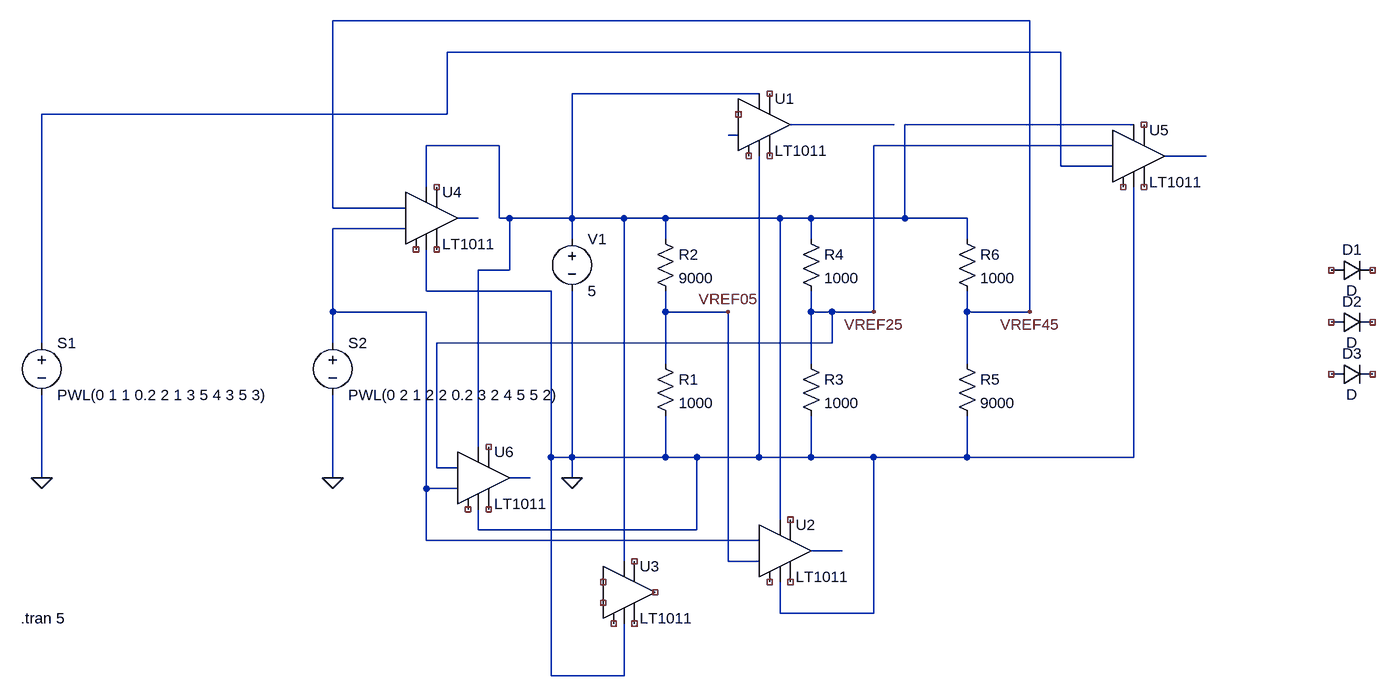
[diagram p0: schematic f1flop.asc]
f1flop.asc, the LTspice schematic file:
Version 4.1
SHEET 1 1592 680
WIRE 1056 -736 -16 -736
WIRE 1104 -688 160 -688
WIRE 640 -624 352 -624
WIRE 160 -592 160 -688
WIRE 160 -592 -464 -592
WIRE 848 -576 688 -576
WIRE 1216 -576 864 -576
WIRE 608 -560 592 -560
WIRE 240 -544 128 -544
WIRE 1184 -544 816 -544
WIRE 1328 -528 1264 -528
WIRE 1104 -512 1104 -688
WIRE 1184 -512 1104 -512
WIRE 128 -480 128 -544
WIRE -16 -448 -16 -736
WIRE 96 -448 -16 -448
WIRE 208 -432 176 -432
WIRE 240 -432 240 -544
WIRE 256 -432 240 -432
WIRE 352 -432 352 -624
WIRE 352 -432 256 -432
WIRE 432 -432 352 -432
WIRE 496 -432 432 -432
WIRE 672 -432 496 -432
WIRE 720 -432 672 -432
WIRE 864 -432 864 -576
WIRE 864 -432 720 -432
WIRE 960 -432 864 -432
WIRE 96 -416 -16 -416
WIRE 352 -400 352 -432
WIRE 496 -400 496 -432
WIRE 720 -400 720 -432
WIRE 960 -400 960 -432
WIRE 256 -352 256 -432
WIRE 256 -352 208 -352
WIRE 128 -320 128 -384
WIRE 320 -320 128 -320
WIRE -16 -288 -16 -416
WIRE 128 -288 -16 -288
WIRE 496 -288 496 -320
WIRE 592 -288 496 -288
WIRE 720 -288 720 -320
WIRE 752 -288 720 -288
WIRE 816 -288 816 -544
WIRE 816 -288 752 -288
WIRE 960 -288 960 -320
WIRE 1056 -288 1056 -736
WIRE 1056 -288 960 -288
WIRE -464 -240 -464 -592
WIRE -16 -240 -16 -288
WIRE 752 -240 752 -288
WIRE 752 -240 144 -240
WIRE 496 -208 496 -288
WIRE 720 -208 720 -288
WIRE 960 -208 960 -288
WIRE 208 -80 208 -352
WIRE 320 -64 320 -320
WIRE 352 -64 352 -320
WIRE 352 -64 320 -64
WIRE 496 -64 496 -128
WIRE 496 -64 352 -64
WIRE 544 -64 496 -64
WIRE 640 -64 640 -528
WIRE 640 -64 544 -64
WIRE 720 -64 720 -128
WIRE 720 -64 640 -64
WIRE 816 -64 720 -64
WIRE 960 -64 960 -128
WIRE 960 -64 816 -64
WIRE 1216 -64 1216 -480
WIRE 1216 -64 960 -64
WIRE 144 -48 144 -240
WIRE 176 -48 144 -48
WIRE -464 -32 -464 -160
WIRE -16 -32 -16 -160
WIRE 288 -32 256 -32
WIRE 352 -32 352 -64
WIRE 128 -16 128 -288
WIRE 176 -16 128 -16
WIRE 672 32 672 -432
WIRE 208 48 208 16
WIRE 544 48 544 -64
WIRE 544 48 208 48
WIRE 128 64 128 -16
WIRE 640 64 128 64
WIRE 768 80 720 80
WIRE 432 96 432 -432
WIRE 592 96 592 -288
WIRE 640 96 592 96
WIRE 672 176 672 128
WIRE 816 176 816 -64
WIRE 816 176 672 176
WIRE 320 272 320 -64
WIRE 432 272 432 192
WIRE 432 272 320 272
FLAG -464 -32 0
FLAG -16 -32 0
FLAG 352 -32 0
FLAG 592 -288 VREF05
FLAG 816 -288 VREF25
FLAG 1056 -288 VREF45
SYMBOL voltage -464 -256 R0
WINDOW 123 0 0 Left 0
WINDOW 39 0 0 Left 0
SYMATTR InstName S1
SYMATTR Value PWL(0 1 1 0.2 2 1 3 5 4 3 5 3)
SYMBOL voltage -16 -256 R0
WINDOW 123 0 0 Left 0
WINDOW 39 0 0 Left 0
SYMATTR InstName S2
SYMATTR Value PWL(0 2 1 2 2 0.2 3 2 4 5 5 2)
SYMBOL voltage 352 -416 R0
WINDOW 123 0 0 Left 0
WINDOW 39 0 0 Left 0
SYMATTR InstName V1
SYMATTR Value 5
SYMBOL res 480 -224 R0
SYMATTR InstName R1
SYMATTR Value 1000
SYMBOL res 480 -416 R0
SYMATTR InstName R2
SYMATTR Value 9000
SYMBOL res 704 -224 R0
SYMATTR InstName R3
SYMATTR Value 1000
SYMBOL res 704 -416 R0
SYMATTR InstName R4
SYMATTR Value 1000
SYMBOL res 944 -224 R0
SYMATTR InstName R5
SYMATTR Value 9000
SYMBOL res 944 -416 R0
SYMATTR InstName R6
SYMATTR Value 1000
SYMBOL Comparators\\LT1011 640 -576 R0
SYMATTR InstName U1
SYMBOL Comparators\\LT1011 672 80 R0
SYMATTR InstName U2
SYMBOL Comparators\\LT1011 432 144 R0
SYMATTR InstName U3
SYMBOL Comparators\\LT1011 128 -432 R0
SYMATTR InstName U4
SYMBOL Comparators\\LT1011 1216 -528 R0
SYMATTR InstName U5
SYMBOL Comparators\\LT1011 208 -32 R0
SYMATTR InstName U6
SYMBOL diode 1520 -336 R270
WINDOW 0 32 32 VTop 2
WINDOW 3 0 32 VBottom 2
SYMATTR InstName D1
SYMBOL diode 1520 -256 R270
WINDOW 0 32 32 VTop 2
WINDOW 3 0 32 VBottom 2
SYMATTR InstName D2
SYMBOL diode 1520 -176 R270
WINDOW 0 32 32 VTop 2
WINDOW 3 0 32 VBottom 2
SYMATTR InstName D3
TEXT -496 184 Left 2 !.tran 5

The netlist it stands for:
* f1flop.asc
V§S1 N001 0 PWL(0 1 1 0.2 2 1 3 5 4 3 5 3)
V§S2 N007 0 PWL(0 2 1 2 2 0.2 3 2 4 5 5 2)
V1 N002 0 5
R1 VREF05 0 1000
R2 N002 VREF05 9000
R3 VREF25 0 1000
R4 N002 VREF25 1000
R5 VREF45 0 9000
R6 N002 VREF45 1000
X§U1 NC_01 N004 NC_02 0 NC_03 NC_04 N003 N002 LT1011
X§U2 NC_05 VREF05 N007 0 NC_06 NC_07 N009 N002 LT1011
X§U3 NC_08 NC_09 NC_10 0 NC_11 NC_12 NC_13 N002 LT1011
X§U4 NC_14 N007 VREF45 0 NC_15 NC_16 N006 N002 LT1011
X§U5 NC_17 N001 VREF25 0 NC_18 NC_19 N005 N002 LT1011
X§U6 NC_20 N007 VREF25 0 NC_21 NC_22 N008 N002 LT1011
D1 NC_23 NC_24 D
D2 NC_25 NC_26 D
D3 NC_27 NC_28 D
.model D D
.lib standard.dio
.tran 5
.lib LTC1.lib
.backanno
.end